# EAGLE design Nu6509_v4 (EAGLE 7.7.0)
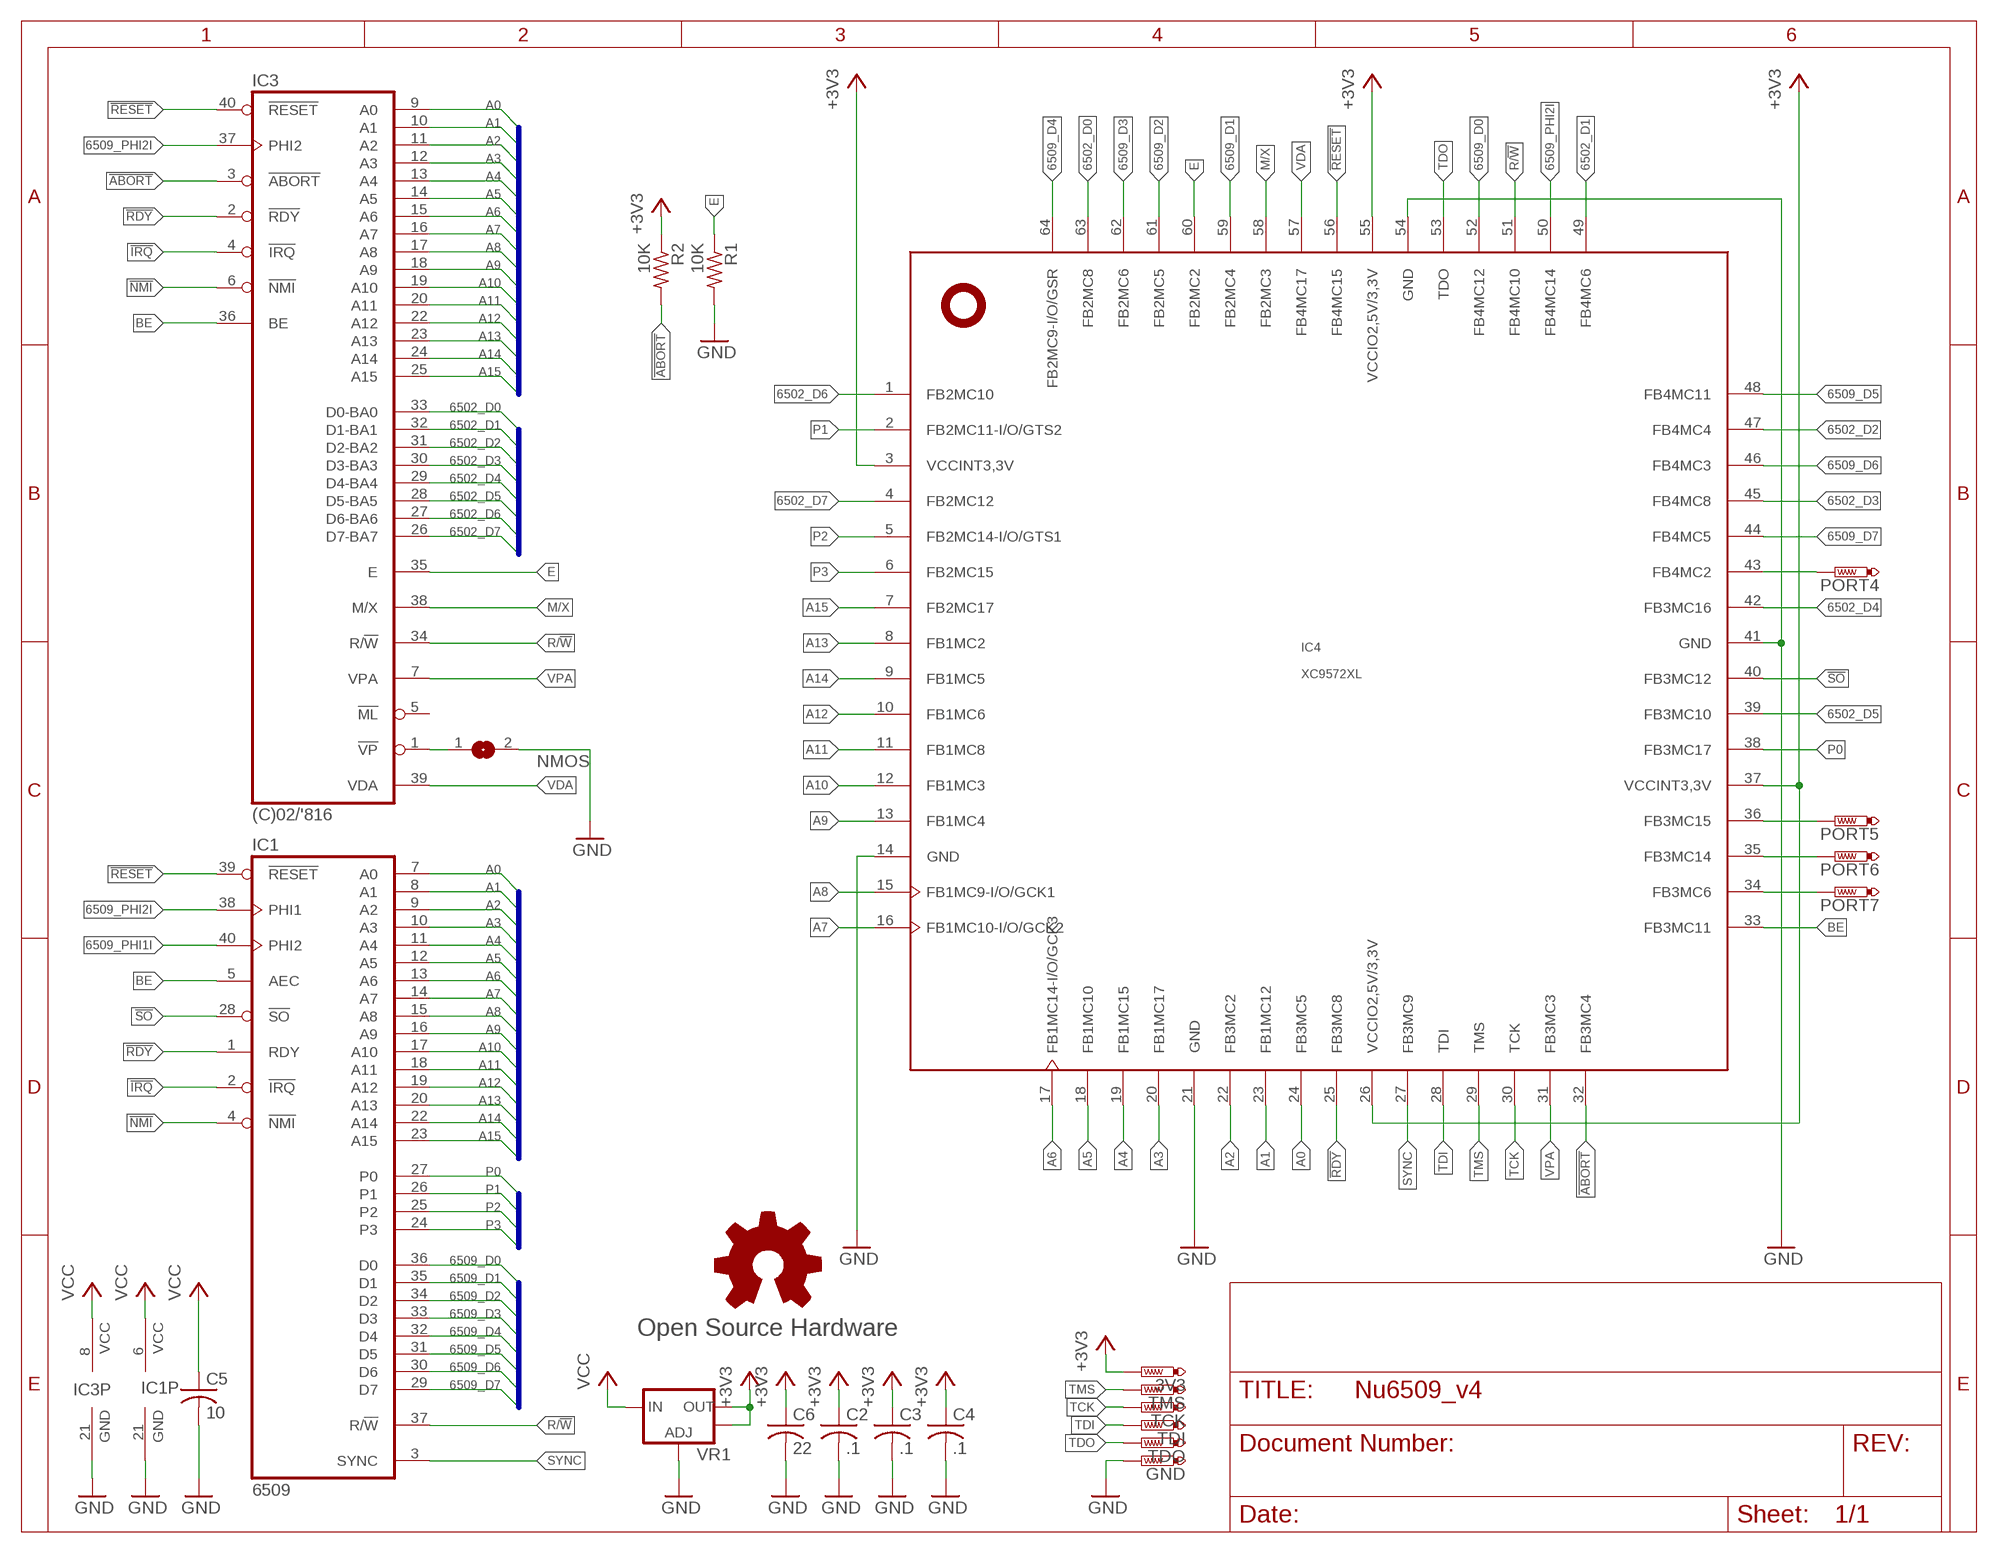
[diagram p0: schematic, sheet 1]

## Parts
3V3  PTR1TP08R  [TP08R]
C2  .1  C-USC0402  [C0402]
C3  .1  C-USC0402  [C0402]
C4  .1  C-USC0402  [C0402]
C5  10  C-USC0805  [C0805]
C6  22  C-USC0805  [C0805]
GND  PTR1TP08R  [TP08R]
GOLD_ORB_SM1  Open Source Hardware  OSHWLOGOLOGO5MM  [OSHW_5MM]
IC1  6509  6509-RP  [DIL40-ROUNDPAD]
IC3  (C)02/'816  W65C816SP-RP  [DIL40-ROUNDPAD]
IC4  XC9572XL  XC9572XLVQG64  [VQFP64]
NMOS  SJ  [SJ]
PORT4  PTR1TP08R  [TP08R]
PORT5  PTR1TP08R  [TP08R]
PORT6  PTR1TP08R  [TP08R]
PORT7  PTR1TP08R  [TP08R]
R1  10K  R-US_R0402  [R0402]
R2  10K  R-US_R0402  [R0402]
TCK  PTR1TP08R  [TP08R]
TDI  PTR1TP08R  [TP08R]
TDO  PTR1TP08R  [TP08R]
TMS  PTR1TP08R  [TP08R]
VR1  V_REG_LM1117SOT223  [SOT223]

## Nets
6502_D0: IC3.33(D0-BA0) IC4.63(FB2MC8)
6502_D1: IC3.32(D1-BA1) IC4.49(FB4MC6)
6502_D2: IC3.31(D2-BA2) IC4.47(FB4MC4)
6502_D3: IC3.30(D3-BA3) IC4.45(FB4MC8)
6502_D4: IC3.29(D4-BA4) IC4.42(FB3MC16)
6502_D5: IC3.28(D5-BA5) IC4.39(FB3MC10)
6502_D6: IC3.27(D6-BA6) IC4.1(FB2MC10)
6502_D7: IC3.26(D7-BA7) IC4.4(FB2MC12)
6509_D0: IC1.36(D0) IC4.52(FB4MC12)
6509_D1: IC1.35(D1) IC4.59(FB2MC4)
6509_D2: IC1.34(D2) IC4.61(FB2MC5)
6509_D3: IC1.33(D3) IC4.62(FB2MC6)
6509_D4: IC1.32(D4) IC4.64(FB2MC9-I/O/GSR)
6509_D5: IC1.31(D5) IC4.48(FB4MC11)
6509_D6: IC1.30(D6) IC4.46(FB4MC3)
6509_D7: IC1.29(D7) IC4.44(FB4MC5)
6509_PHI1I: IC1.40(PHI2)
6509_PHI2I: IC1.38(PHI1) IC3.37(PHI2) IC4.50(FB4MC14)
!ABORT: IC3.3(!ABORT) IC4.32(FB3MC4) R2.2
!IRQ: IC1.2(!IRQ) IC3.4(!IRQ)
!NMI: IC1.4(!NMI) IC3.6(!NMI)
!RDY: IC1.1(RDY) IC3.2(!RDY) IC4.25(FB3MC8)
!RESET: IC1.39(!RESET) IC3.40(!RESET) IC4.56(FB4MC15)
!SO: IC1.28(!SO) IC4.40(FB3MC12)
+3V3: 3V3.TP C2.1 C3.1 C4.1 C6.1 IC4.3(VCCINT3,3V) IC4.26(VCCIO2,5V/3,3V) IC4.37(VCCINT3,3V) IC4.55(VCCIO2,5V/3,3V) R2.1 VR1.2(OUT) VR1.4(OUT)
A0: IC1.7(A0) IC3.9(A0) IC4.24(FB3MC5)
A1: IC1.8(A1) IC3.10(A1) IC4.23(FB1MC12)
A2: IC1.9(A2) IC3.11(A2) IC4.22(FB3MC2)
A3: IC1.10(A3) IC3.12(A3) IC4.20(FB1MC17)
A4: IC1.11(A4) IC3.13(A4) IC4.19(FB1MC15)
A5: IC1.12(A5) IC3.14(A5) IC4.18(FB1MC10)
A6: IC1.13(A6) IC3.15(A6) IC4.17(FB1MC14-I/O/GCK3)
A7: IC1.14(A7) IC3.16(A7) IC4.16(FB1MC10-I/O/GCK2)
A8: IC1.15(A8) IC3.17(A8) IC4.15(FB1MC9-I/O/GCK1)
A9: IC1.16(A9) IC3.18(A9) IC4.13(FB1MC4)
A10: IC1.17(A10) IC3.19(A10) IC4.12(FB1MC3)
A11: IC1.18(A11) IC3.20(A11) IC4.11(FB1MC8)
A12: IC1.19(A12) IC3.22(A12) IC4.10(FB1MC6)
A13: IC1.20(A13) IC3.23(A13) IC4.8(FB1MC2)
A14: IC1.22(A14) IC3.24(A14) IC4.9(FB1MC5)
A15: IC1.23(A15) IC3.25(A15) IC4.7(FB2MC17)
BE: IC1.5(AEC) IC3.36(BE) IC4.33(FB3MC11)
E: IC3.35(E) IC4.60(FB2MC2) R1.1
GND: C2.2 C3.2 C4.2 C5.2 C6.2 GND.TP IC1.21(GND) IC3.21(GND) IC4.14(GND) IC4.21(GND) IC4.41(GND) IC4.54(GND) NMOS.2 R1.2 VR1.1(ADJ)
M/X: IC3.38(M/X) IC4.58(FB2MC3)
N$2: IC3.1(!VP) NMOS.1
P0: IC1.27(P0) IC4.38(FB3MC17)
P1: IC1.26(P1) IC4.2(FB2MC11-I/O/GTS2)
P2: IC1.25(P2) IC4.5(FB2MC14-I/O/GTS1)
P3: IC1.24(P3) IC4.6(FB2MC15)
PORT4: IC4.43(FB4MC2) PORT4.TP
PORT5: IC4.36(FB3MC15) PORT5.TP
PORT6: IC4.35(FB3MC14) PORT6.TP
PORT7: IC4.34(FB3MC6) PORT7.TP
R/!W: IC1.37(R/!W) IC3.34(R/!W) IC4.51(FB4MC10)
SYNC: IC1.3(SYNC) IC4.27(FB3MC9)
TCK: IC4.30(TCK) TCK.TP
TDI: IC4.28(TDI) TDI.TP
TDO: IC4.53(TDO) TDO.TP
TMS: IC4.29(TMS) TMS.TP
VCC: C5.1 IC1.6(VCC) IC3.8(VCC) VR1.3(IN)
VDA: IC3.39(VDA) IC4.57(FB4MC17)
VPA: IC3.7(VPA) IC4.31(FB3MC3)
Unconnected: IC3.5(!ML)

## Buses
A[0..15]
6502_D[0..7]
P[0..3]
6509_D[0..7]

## Library data of the parts
3V3 GND PORT4-PORT7 TCK TDI TDO TMS = testpad:PTR1: TEST PIN
C2-C6 = rcl:C-US: CAPACITOR, American symbol
GOLD_ORB_SM1 = oshw:OSHWLOGO: The OSHW logo for PCB layout
IC1 = commodore:6509
IC3 = commodore:W65C816SP: WDC's 16 bits successor of the -6 5 0 2-
IC4 = xilinx_xc95XXXxl:XC9572XLVQG64
NMOS = jumper-jlb:SJ: SMD solder JUMPER
R1 R2 = rcl:R-US_: RESISTOR, American symbol
VR1 = SparkFun:V_REG_LM1117: Voltage Regulator LM1117 Standard adjustable voltage regulator but in SMD form. Spark Fun Electronics SKU : COM-00595

## Board
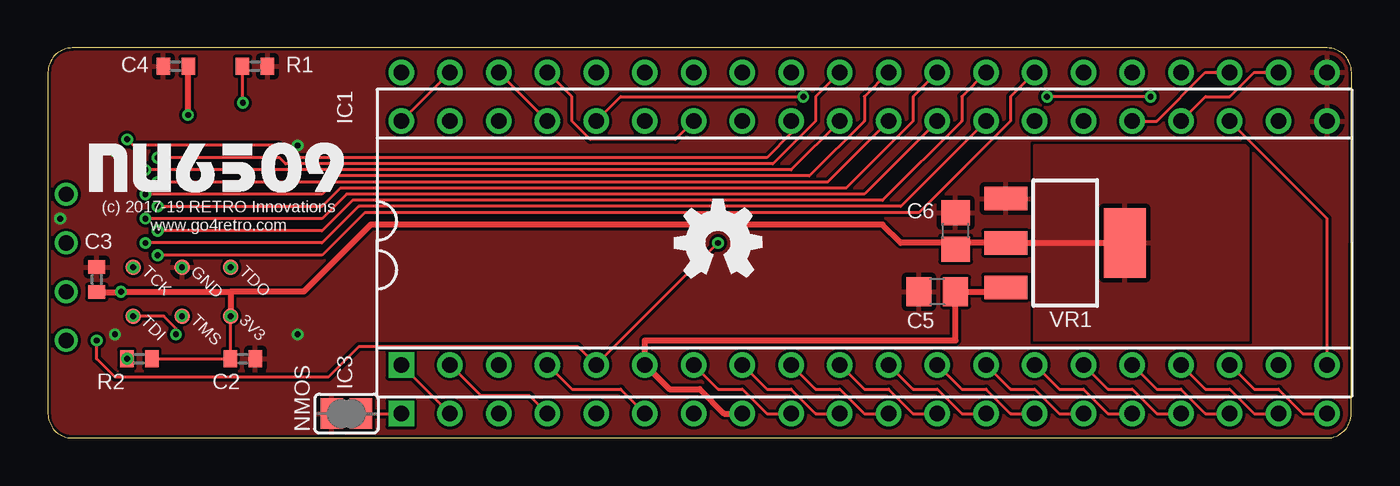
[diagram p1: board, top side]
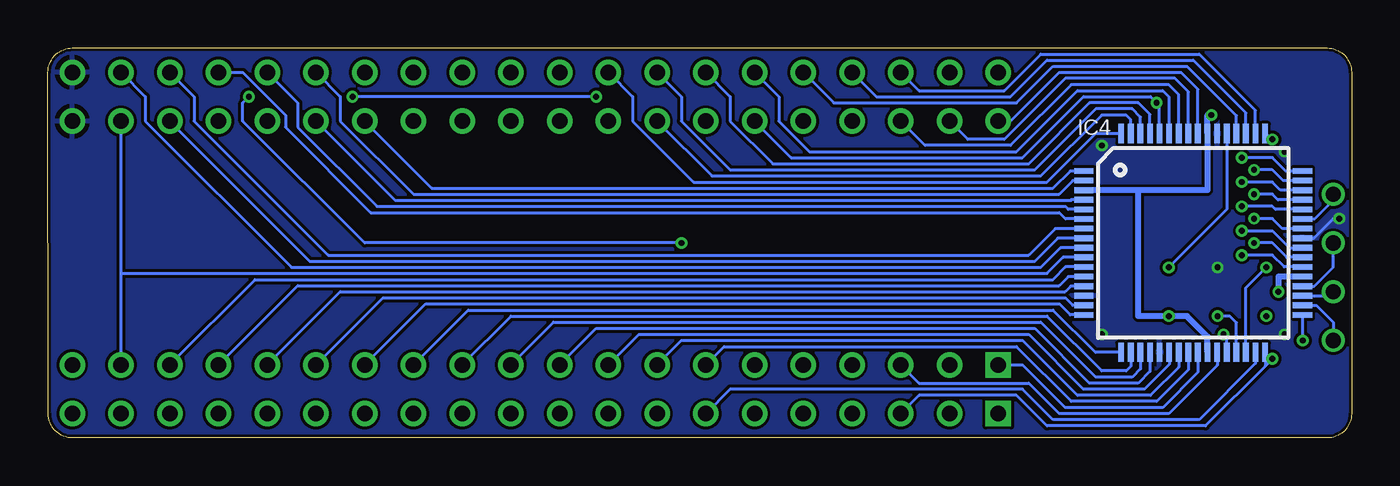
[diagram p2: board, bottom side, seen from below]

Size 67.94 x 20.32 mm. Coordinates in mm from the lower left corner, seen from the top.
Outline: 0,19.05 0,1.27 arc90 1.27,0 66.66,0 arc90 67.93,1.27 67.94,19.05 arc90 66.67,20.32 1.27,20.32 arc90 0,19.05
Copper layers (1*16): Top 0.035mm / dielectric 1.5mm / Bottom 0.035mm
Design rules "hackvana *": minimum track width 6mil, minimum drill 0.3mm, track to track 6mil, track to pad 6mil, pad to pad 6mil, via to via 6mil, smd to smd 0mil, copper to edge 6mil, drill to drill 6mil, minimum pad ring 10mil, minimum via ring 6mil, stop-mask expansion 2mil, vias tented up to drill 100mil, thermal gap 10mil

### Footprints (pad centres in the part's own frame; a part is rotated, then mirrored left to right if it is on the bottom)
TP08R = smd 0.8 x 0.8: TP 0,0
C0402 = smd 0.7 x 0.9: 1 -0.65,0; 2 0.65,0
C0805 = smd 1.3 x 1.5: 1 -0.95,0; 2 0.95,0
DIL40-ROUNDPAD = drill 0.813 square: 1 -24.13,-7.62 | drill 0.813: 2 -21.59,-7.62; 3 -19.05,-7.62; 4 -16.51,-7.62; 5 -13.97,-7.62; 6 -11.43,-7.62; 7 -8.89,-7.62; 8 -6.35,-7.62; 9 -3.81,-7.62; 10 -1.27,-7.62; 11 1.27,-7.62; 12 3.81,-7.62; 13 6.35,-7.62; 14 8.89,-7.62; 15 11.43,-7.62; 16 13.97,-7.62; 17 16.51,-7.62; 18 19.05,-7.62; 19 21.59,-7.62; 20 24.13,-7.62; 21 24.13,7.62; 22 21.59,7.62; 23 19.05,7.62; 24 16.51,7.62; 25 13.97,7.62; 26 11.43,7.62; 27 8.89,7.62; 28 6.35,7.62; 29 3.81,7.62; 30 1.27,7.62; 31 -1.27,7.62; 32 -3.81,7.62; 33 -6.35,7.62; 34 -8.89,7.62; 35 -11.43,7.62; 36 -13.97,7.62; 37 -16.51,7.62; 38 -19.05,7.62; 39 -21.59,7.62; 40 -24.13,7.62
VQFP64 = smd 1 x 0.3: 1 -5.7,3.75; 2 -5.7,3.25; 3 -5.7,2.75; 4 -5.7,2.25; 5 -5.7,1.75; 6 -5.7,1.25; 7 -5.7,0.75; 8 -5.7,0.25; 9 -5.7,-0.25; 10 -5.7,-0.75; 11 -5.7,-1.25; 12 -5.7,-1.75; 13 -5.7,-2.25; 14 -5.7,-2.75; 15 -5.7,-3.25; 16 -5.7,-3.75; 33 5.7,-3.75; 34 5.7,-3.25; 35 5.7,-2.75; 36 5.7,-2.25; 37 5.7,-1.75; 38 5.7,-1.25; 39 5.7,-0.75; 40 5.7,-0.25; 41 5.7,0.25; 42 5.7,0.75; 43 5.7,1.25; 44 5.7,1.75; 45 5.7,2.25; 46 5.7,2.75; 47 5.7,3.25; 48 5.7,3.75 | smd 0.3 x 1: 17 -3.75,-5.7; 18 -3.25,-5.7; 19 -2.75,-5.7; 20 -2.25,-5.7; 21 -1.75,-5.7; 22 -1.25,-5.7; 23 -0.75,-5.7; 24 -0.25,-5.7; 25 0.25,-5.7; 26 0.75,-5.7; 27 1.25,-5.7; 28 1.75,-5.7; 29 2.25,-5.7; 30 2.75,-5.7; 31 3.25,-5.7; 32 3.75,-5.7; 49 3.75,5.7; 50 3.25,5.7; 51 2.75,5.7; 52 2.25,5.7; 53 1.75,5.7; 54 1.25,5.7; 55 0.75,5.7; 56 0.25,5.7; 57 -0.25,5.7; 58 -0.75,5.7; 59 -1.25,5.7; 60 -1.75,5.7; 61 -2.25,5.7; 62 -2.75,5.7; 63 -3.25,5.7; 64 -3.75,5.7
SJ = smd 1.168 x 1.6: 1 -0.762,0; 2 0.762,0
R0402 = smd 0.7 x 0.9: 1 -0.65,0; 2 0.65,0
SOT223 = smd 1.219 x 2.235: 1 -2.311,-3.099; 2 0,-3.099; 3 2.311,-3.099 | smd 3.6 x 2.2: 4 0,3.099

### Placement (x,y rotation side)
3V3  9.52,6.35 0 top
C2  10.16,4.13 0 top
C3  2.54,8.26 90 top
C4  6.67,19.37 180 top
C5  46.35,7.62 180 top
C6  47.31,10.8 90 top
GND  6.98,8.89 0 top
GOLD_ORB_SM1  34.92,10.16 0 top
IC1  42.55,11.43 0 top
IC3  42.55,8.89 0 top
IC4  8.25,10.16 0 bottom
NMOS  15.56,1.27 180 top
PORT4  0.95,12.7 0 bottom
PORT5  0.95,10.16 0 bottom
PORT6  0.95,7.62 0 bottom
PORT7  0.95,5.08 0 bottom
R1  10.79,19.37 0 top
R2  4.76,4.13 180 top
TCK  4.45,8.89 0 top
TDI  4.45,6.35 0 top
TDO  9.52,8.89 0 top
TMS  6.98,6.35 0 top
VR1  53.02,10.16 270 top

### Tracks (layer width: path | path; a pad name or v marks a point on that pad's centre or on a via)
6502_D0
  Bottom 0.152: IC3.33 33.34,13.65 16.19,13.65 13.02,16.83 11.75,16.83 11.5,16.59 IC4.63
6502_D1  (via drill 0.3)
  Top 0.152: IC3.32 38.73,15.88 37.46,14.61 12.7,14.61 12.06,15.24 4.45,15.24 v4.13,15.56
  Bottom 0.152: IC4.49 4.43,15.86 v4.13,15.56
6502_D2  (via drill 0.3)
  Top 0.152: IC3.31 38.73,13.97 v5.08,13.97
  Bottom 0.152: IC4.47 3.57,13.41 4.13,13.97 v5.08,13.97
6502_D3  (via drill 0.3)
  Top 0.152: IC3.30 40.64,13.34 14.92,13.34 14.29,12.7 v5.08,12.7
  Bottom 0.152: IC4.45 3.84,12.41 4.13,12.7 v5.08,12.7
6502_D4  (via drill 0.3)
  Top 0.152: IC3.29 42.55,12.7 15.56,12.7 14.29,11.43 v5.08,11.43
  Bottom 0.152: IC4.42 3.61,10.91 4.13,11.43 v5.08,11.43
6502_D5  (via drill 0.3)
  Top 0.152: IC3.28 44.45,12.07 16.19,12.07 14.29,10.16 v5.08,10.16
  Bottom 0.152: IC4.39 3.38,9.41 4.13,10.16 v5.08,10.16
6502_D6
  Bottom 0.152: IC3.27 47.94,13.02 15.56,13.02 14.66,13.91 IC4.1
6502_D7
  Bottom 0.152: IC3.26 49.85,12.38 14.61,12.38 14.63,12.41 IC4.4
6509_D0
  Bottom 0.152: IC1.36 26.99,17.46 17.46,17.46 15.56,19.37 8.57,19.37 6,16.8 IC4.52
6509_D1
  Bottom 0.152: IC1.35 29.84,17.78 29.84,16.51 28.26,14.92 17.46,14.92 14.29,18.1 9.84,18.1 9.5,17.76 IC4.59
6509_D2
  Bottom 0.152: IC1.34 32.38,17.78 32.38,16.51 30.16,14.29 16.83,14.29 13.65,17.46 11.11,17.46 10.5,16.86 IC4.61
6509_D3
  Bottom 0.152: IC1.33 34.92,17.78 34.92,16.51 32.38,13.97 16.51,13.97 13.34,17.15 11.43,17.15 11,16.72 IC4.62
6509_D4
  Bottom 0.152: IC1.32 37.46,17.78 37.46,16.51 34.29,13.34 15.88,13.34 13.35,15.86 IC4.64
6509_D5  (via drill 0.3)
  Top 0.152: IC1.31 40.01,17.78 40.01,16.51 37.78,14.29 12.38,14.29 12.06,14.61 v5.71,14.61
  Bottom 0.152: IC4.48 3.43,13.91 4.13,14.61 v5.71,14.61
6509_D6  (via drill 0.3)
  Top 0.152: IC1.30 42.55,17.78 42.55,16.51 39.69,13.65 14.61,13.65 14.29,13.34 v5.71,13.34
  Bottom 0.152: IC4.46 3.7,12.91 4.13,13.34 v5.71,13.34
6509_D7  (via drill 0.3)
  Top 0.152: IC1.29 45.09,17.78 45.09,16.51 41.59,13.02 15.24,13.02 14.29,12.07 v5.71,12.07
  Bottom 0.152: IC4.44 3.97,11.91 4.13,12.07 v5.71,12.07
6509_PHI2I
  Top 0.152: IC1.38 IC3.37
  Bottom 0.152: IC1.38 22.54,18.1 18.1,18.1 16.19,20 7.94,20 5,17.07 IC4.50
!ABORT  (via drill 0.3)
  Top 0.152: R2.2 v4.13,4.13
  Bottom 0.152: IC4.32 4.5,3.75 | 4.5,3.75 7.62,0.64 15.88,0.64 17.46,2.22 22.54,2.22 IC3.3 | v4.13,4.13 4.5,3.75
!IRQ
  Top 0.152: IC1.2 22.54,2.22 25.08,2.22 IC3.4
!NMI
  Top 0.152: IC1.4 27.3,2.54 29.84,2.54 IC3.6
!RDY
  Top 0.152: IC1.1 IC3.2
  Bottom 0.152: IC1.1 17.14,3.81 14.92,1.59 9.84,1.59 8,3.43 IC4.25
!RESET
  Top 0.152: IC1.39 IC3.40
  Bottom 0.152: IC3.40 17.78,16.51 15.24,19.05 8.89,19.05 8,18.16 IC4.56
!SO  (via drill 0.3)
  Top 0.152: IC1.28 47.62,17.78 47.62,16.51 43.5,12.38 15.88,12.38 14.29,10.8 v5.71,10.8
  Bottom 0.152: v5.71,10.8 4.13,10.8 3.24,9.91 IC4.40
+3V3  (via drill 0.3)
  Top 0.152: 3V3.TP 9.52,4.13 C2.1 R2.1
  Top 0.305: 9.52,7.62 v3.81,7.62 3.81,7.61 C3.1 | 9.52,7.62 3V3.TP | v7.3,16.83 7.3,19.37 C4.1 | VR1.4 VR1.2 47.31,10.16 | 9.52,7.62 13.34,7.62 16.83,11.11 43.5,11.11 44.45,10.16 47.31,10.16 | 47.31,10.16 C6.1
  Bottom 0.305: IC4.37 3.81,8.41 v3.81,7.62 | 11.11,12.91 7.5,12.91 IC4.55 7.5,16.83 v7.3,16.83 | 11.11,12.91 IC4.3 | 11.11,12.91 11.11,6.35 3V3.TP 8.57,6.35 7.5,5.28 IC4.26
  other vias: 9.52,6.35
  pour Top: 51.44,15.24 62.55,15.24 62.55,5.08 51.44,5.08
A0
  Top 0.152: IC1.7 34.92,2.54 36.2,2.54 37.46,1.27 IC3.9
  Bottom 0.152: IC1.7 32.7,4.76 17.46,4.76 14.61,1.91 10.16,1.91 8.5,3.56 IC4.24
A1
  Top 0.152: IC1.8 37.46,2.54 38.73,2.54 40.01,1.27 IC3.10
  Bottom 0.152: IC1.8 34.92,5.08 17.14,5.08 14.29,2.22 10.48,2.22 9,3.7 IC4.23
A2
  Top 0.152: IC1.9 40.01,2.54 41.27,2.54 42.55,1.27 IC3.11
  Bottom 0.152: IC1.9 37.15,5.4 16.83,5.4 13.97,2.54 10.79,2.54 9.5,3.83 IC4.22
A3
  Top 0.152: IC1.10 42.55,2.54 43.81,2.54 45.09,1.27 IC3.12
  Bottom 0.152: IC1.10 39.37,5.72 16.51,5.72 13.65,2.86 11.11,2.86 10.5,3.47 IC4.20
A4
  Top 0.152: IC1.11 45.09,2.54 46.35,2.54 47.62,1.27 IC3.13
  Bottom 0.152: IC1.11 41.59,6.03 16.19,6.03 13.34,3.18 11.43,3.18 11,3.6 IC4.19
A5
  Top 0.152: IC1.12 47.62,2.54 48.89,2.54 50.16,1.27 IC3.14
  Bottom 0.152: IC1.12 43.81,6.35 15.88,6.35 13.02,3.49 11.75,3.49 11.5,3.74 IC4.18
A6
  Top 0.152: IC1.13 50.16,2.54 51.44,2.54 52.7,1.27 IC3.15
  Bottom 0.152: IC1.13 46.04,6.67 15.56,6.67 13.35,4.46 IC4.17
A7
  Top 0.152: IC1.14 52.7,2.54 53.98,2.54 55.25,1.27 IC3.16
  Bottom 0.152: IC1.14 48.26,6.99 15.24,6.99 14.66,6.41 IC4.16
A8
  Top 0.152: IC1.15 55.25,2.54 56.52,2.54 57.78,1.27 IC3.17
  Bottom 0.152: IC1.15 50.48,7.3 14.92,7.3 14.53,6.91 IC4.15
A9
  Top 0.152: IC1.16 57.78,2.54 59.05,2.54 60.33,1.27 IC3.18
  Bottom 0.152: IC1.16 52.7,7.62 14.92,7.62 14.63,7.91 IC4.13
A10
  Top 0.152: IC1.17 60.33,2.54 61.59,2.54 62.86,1.27 IC3.19
  Bottom 0.152: IC1.17 54.93,7.94 15.24,7.94 14.77,8.41 IC4.12
A11
  Top 0.152: IC1.18 62.86,2.54 64.14,2.54 65.41,1.27 IC3.20
  Bottom 0.152: IC1.18 57.15,8.26 15.56,8.26 14.9,8.91 IC4.11
A12
  Bottom 0.152: 64.14,8.57 15.88,8.57 15.04,9.41 IC4.10 | 64.14,8.57 IC3.22 | IC1.19 64.14,8.57
A13
  Top 0.152: IC1.20 66.67,11.43 IC3.23
  Bottom 0.152: IC3.23 54.29,9.21 16.51,9.21 15.31,10.41 IC4.8
A14
  Top 0.152: IC1.22 62.86,19.05 61.59,17.78 60.33,17.78 IC3.24
  Bottom 0.152: IC1.22 62.86,17.78 62.86,16.51 55.25,8.89 16.19,8.89 15.17,9.91 IC4.9
A15
  Top 0.152: IC1.23 60.33,19.05 57.78,16.51 IC3.25
  Bottom 0.152: IC1.23 60.33,17.78 60.33,16.51 53.34,9.53 16.83,9.53 15.44,10.91 IC4.7
BE  (via drill 0.3)
  Top 0.152: IC3.36 29.84,17.78 v39.37,17.78 | v34.92,10.16 IC1.5 27.62,4.76 16.19,4.76 14.61,3.18 3.49,3.18 2.54,4.13 v2.54,5.08 | v57.47,17.78 v52.07,17.78
  Bottom 0.152: v34.92,10.16 51.44,10.16 57.78,16.51 57.78,17.46 v57.47,17.78 | v39.37,17.78 v52.07,17.78 | v2.54,5.08 2.54,6.4 IC4.33
E  (via drill 0.3)
  Top 0.152: v10.16,17.46 10.16,19.35 R1.1
  Bottom 0.152: IC3.35 29.21,14.61 17.14,14.61 13.97,17.78 10.48,17.78 v10.16,17.46 10,17.31 IC4.60
GND  (via drill 0.3)
  Bottom 0.152: IC4.41 1.97,10.41 0.95,11.43 v0.63,11.43
  other vias: 6.98,8.89 13.02,5.4 3.49,5.4 3.49,14.92 13.02,15.24
  pour Top (rank 2): 1.27,20.32 66.67,20.32 arc-90 67.94,19.05 67.94,1.27 arc-90 66.67,0 1.27,0 arc-90 0,1.27 0,19.05 arc-90
  pour Bottom (rank 2): 1.27,20.32 66.67,20.32 arc-90 67.94,19.05 67.94,1.27 arc-90 66.67,0 1.27,0 arc-90 0,1.27 0,19.05 arc-90
M/X
  Bottom 0.152: IC4.58 9,17.9 9.52,18.41 14.61,18.41 17.78,15.24 22.22,15.24 IC3.38
N$2
  Top 0.152: NMOS.1 IC3.1
P0  (via drill 0.3)
  Top 0.152: IC1.27 50.16,17.78 50.16,16.51 45.4,11.75 16.51,11.75 14.29,9.53 v5.71,9.53
  Bottom 0.152: IC4.38 3.51,8.91 4.13,9.53 v5.71,9.53
P1
  Bottom 0.152: IC1.26 52.7,17.78 52.7,16.51 48.89,12.7 15.24,12.7 14.53,13.41 IC4.2
P2
  Bottom 0.152: IC1.25 54.93,17.46 54.93,16.19 50.8,12.07 14.92,12.07 14.77,11.91 IC4.5
P3
  Bottom 0.152: IC1.24 57.78,19.05 55.56,16.83 55.56,16.19 51.12,11.75 15.24,11.75 14.9,11.41 IC4.6
PORT4  (via drill 0.8)
  Bottom 0.152: IC4.43 1.92,11.41 0.95,12.38 PORT4.TP
  other vias: 0.95,12.7
PORT5  (via drill 0.8)
  Bottom 0.152: IC4.36 1.93,7.91 0.95,8.89 PORT5.TP
  other vias: 0.95,10.16
PORT6  (via drill 0.8)
  Bottom 0.152: IC4.35 1.16,7.41 PORT6.TP
  other vias: 0.95,7.62
PORT7  (via drill 0.8)
  Bottom 0.152: IC4.34 1.83,6.91 0.95,6.03 PORT7.TP
  other vias: 0.95,5.08
R/!W
  Top 0.152: IC3.34 32.7,15.56 28.26,15.56 27.3,16.51 27.3,17.78 IC1.37
  Bottom 0.152: IC1.37 24.77,17.78 17.78,17.78 15.88,19.69 8.25,19.69 5.5,16.94 IC4.51
SYNC
  Bottom 0.152: IC1.3 22.54,2.86 16.83,2.86 15.24,1.27 9.52,1.27 7,3.79 IC4.27
TCK  (via drill 0.3)
  Bottom 0.152: IC4.30 5.5,7.83 TCK.TP
  other vias: 4.45,8.89
TDI  (via drill 0.3)
  Top 0.152: v6.67,5.4 6.67,5.72 6.03,6.35 TDI.TP
  Bottom 0.152: IC4.28 6.5,5.24 v6.67,5.4
  other vias: 4.45,6.35
TDO  (via drill 0.3)
  Bottom 0.152: IC4.53 6.5,11.91 TDO.TP
  other vias: 9.52,8.89
TMS  (via drill 0.3)
  Bottom 0.152: IC4.29 6,6.01 6.35,6.35 TMS.TP
  other vias: 6.98,6.35
VCC
  Top 0.305: IC3.8 35.24,1.27 33.97,2.54 32.38,2.54 IC1.6 31.12,5.08 47.3,5.08 C5.1 49.92,7.62 VR1.3
VDA
  Bottom 0.152: IC3.39 20,15.56 18.1,15.56 14.92,18.73 9.21,18.73 8.5,18.03 IC4.57
VPA
  Bottom 0.152: IC3.7 32.38,2.54 17.14,2.54 15.56,0.95 7.94,0.95 5,3.89 IC4.31

### Text on the board
tNames: C:/Users/brain/projects/Nu6509/doc/Nu6509.bmp | (c) 2017-19 RETRO Innovations | www.go4retro.com